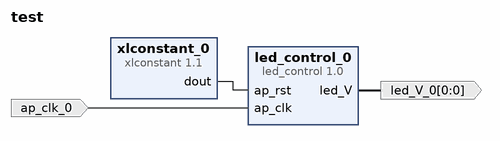
[diagram p0: block diagram of the top level]
# Vivado block design test, xc7z020clg400-2, Vivado 2018.3
create_bd_design test

create_bd_port -dir I -type clk ap_clk_0
create_bd_port -dir O -from 0 -to 0 -type data led_V_0

create_bd_cell -type ip -vlnv xilinx.com:hls:led_control:1.0 led_control_0
create_bd_cell -type ip -vlnv xilinx.com:ip:xlconstant:1.1 xlconstant_0
set_property -dict {CONFIG.CONST_VAL 0} [get_bd_cells xlconstant_0]

# ---- connections ----

connect_bd_net [get_bd_pins xlconstant_0/dout] [get_bd_pins led_control_0/ap_rst]
connect_bd_net -net ap_clk_0_1 [get_bd_ports ap_clk_0] [get_bd_pins led_control_0/ap_clk]
connect_bd_net [get_bd_pins led_control_0/led_V] [get_bd_ports led_V_0]

validate_bd_design
save_bd_design
